# Altium project 两位数码管显示模块.PRJPCB
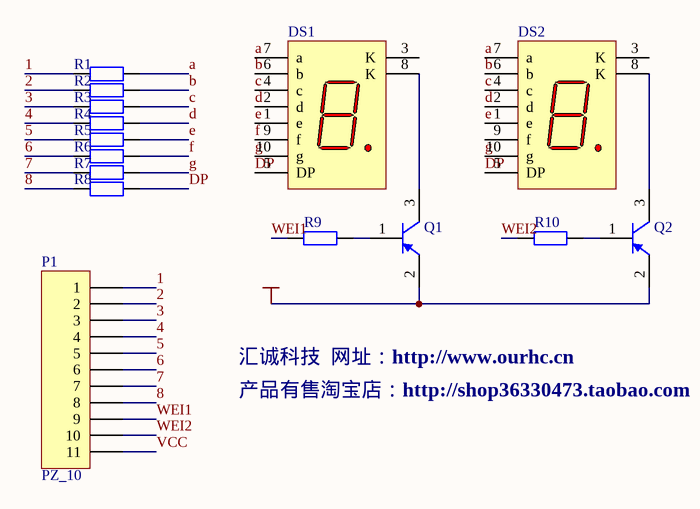
[diagram p0: 两位数码管显示模块.SCHDOC]
1 sheet, 15 parts. Net scope: global (net labels, ports and power ports of the same name join across sheets).
Board file: 两位数码管显示模块.PcbDoc

## Sheet 两位数码管显示模块.SCHDOC
size A4

### Parts
DS1  DLSMG_B  [LED-BSR]  (value not drawn)
DS2  DLSMG_B  [LED-BSR]  (value not drawn)
P1  PZ_10  [HDR-10]
Q1  TPSJG_PNP  [SO-G3]  (value not drawn)
Q2  TPSJG_PNP  [SO-G3]  (value not drawn)
R1  Res  [0805]  (value not drawn)
R2  Res  [0805]  (value not drawn)
R3  Res  [0805]  (value not drawn)
R4  Res  [0805]  (value not drawn)
R5  Res  [0805]  (value not drawn)
R6  Res  [0805]  (value not drawn)
R7  Res  [0805]  (value not drawn)
R8  Res  [0805]  (value not drawn)
R9  Res  [0805]  (value not drawn)
R10  Res  [0805]  (value not drawn)

### Nets
VCC: P1.11 Q1.2(E) Q2.2(E)
1: P1.1 R1.1
2: P1.2 R2.1
3: P1.3 R3.1
4: P1.4 R4.1
5: P1.5 R5.1
6: P1.6 R6.1
7: P1.7 R7.1
8: P1.8 R8.1
a: DS1.7(a) DS2.7(a) R1.2
b: DS1.6(b) DS2.6(b) R2.2
c: DS1.4(c) DS2.4(c) R3.2
d: DS1.2(d) DS2.2(d) R4.2
DP: DS1.5(DP) DS2.5(DP) R8.2
e: DS1.1(e) DS2.1(e) R5.2
f: DS1.9(f) R6.2
g: DS1.10(g) DS2.10(g) R7.2
WEI1: P1.9 R9.1
WEI2: P1.10 R10.1
NetDS1_8: DS1.8(K) Q1.3(C)
NetDS2_8: DS2.8(K) Q2.3(C)
NetQ1_1: Q1.1(B) R9.2
NetQ2_1: Q2.1(B) R10.2

Not connected (* = marked no-connect by the designer): DS1 3(K); DS2 3(K) 9(f)

### Notes on the sheet
- 汇诚科技  网址：http://www.ourhc.cn
- 产品有售淘宝店：http://shop36330473.taobao.com

### Library data of the parts
DS1 DS2 = DLSMG_B: 独立共阳数码管; MinimumIntensity: 360 ucd; Note: IF = 5 mA; Colour: High Efficiency Red (HER); Note: Pins 1 and 6 are redundant Cathodes.; Published: 8-Jun-2000; LatestRevisionDate: 17-Dec-2003; LatestRevisionNote: Schematic revised, PCB Footprint replaced.; DatasheetDocument: 19-Feb-2002; PackageDocument: 19-Feb-2002; PackageReference: A; Publisher: Altium Limited
P1 = PZ_10: 排针——10; LatestRevisionDate: 17-Jul-2002; LatestRevisionNote: Re-released for DXP Platform.; Publisher: Altium Limited
Q1 Q2 = TPSJG_PNP: 贴片三极管——PNP; Published: 8-Jun-2000; LatestRevisionDate: 15-Jan-2003; LatestRevisionNote: PCB Footprint 'BCY-W3/D4.7' replaced; DatasheetDocument: 1997; PackageReference: TO-92A; Publisher: Altium Limited; Code_JEDEC: TO-92A
R1-R10 = Res: 电阻; Value: 1K; Published: 8-Jun-2000; LatestRevisionDate: 17-Jul-2002; LatestRevisionNote: Re-released for DXP Platform.; Publisher: Altium Limited